# Altium schematic sheet Motor Interface - Connectors.SchDoc: Motor Interface - Connectors
size B; Organization: Midnight Sun Solar Rayce Car Team; Address1: University of Waterloo; Address2: 200 University Ave W; Address3: Waterloo, ON, Canada; Address4: N2L 3E9; DocumentNumber: 2; SheetNumber: 2; SheetTotal: 6; Website: www.uwmidsun.com
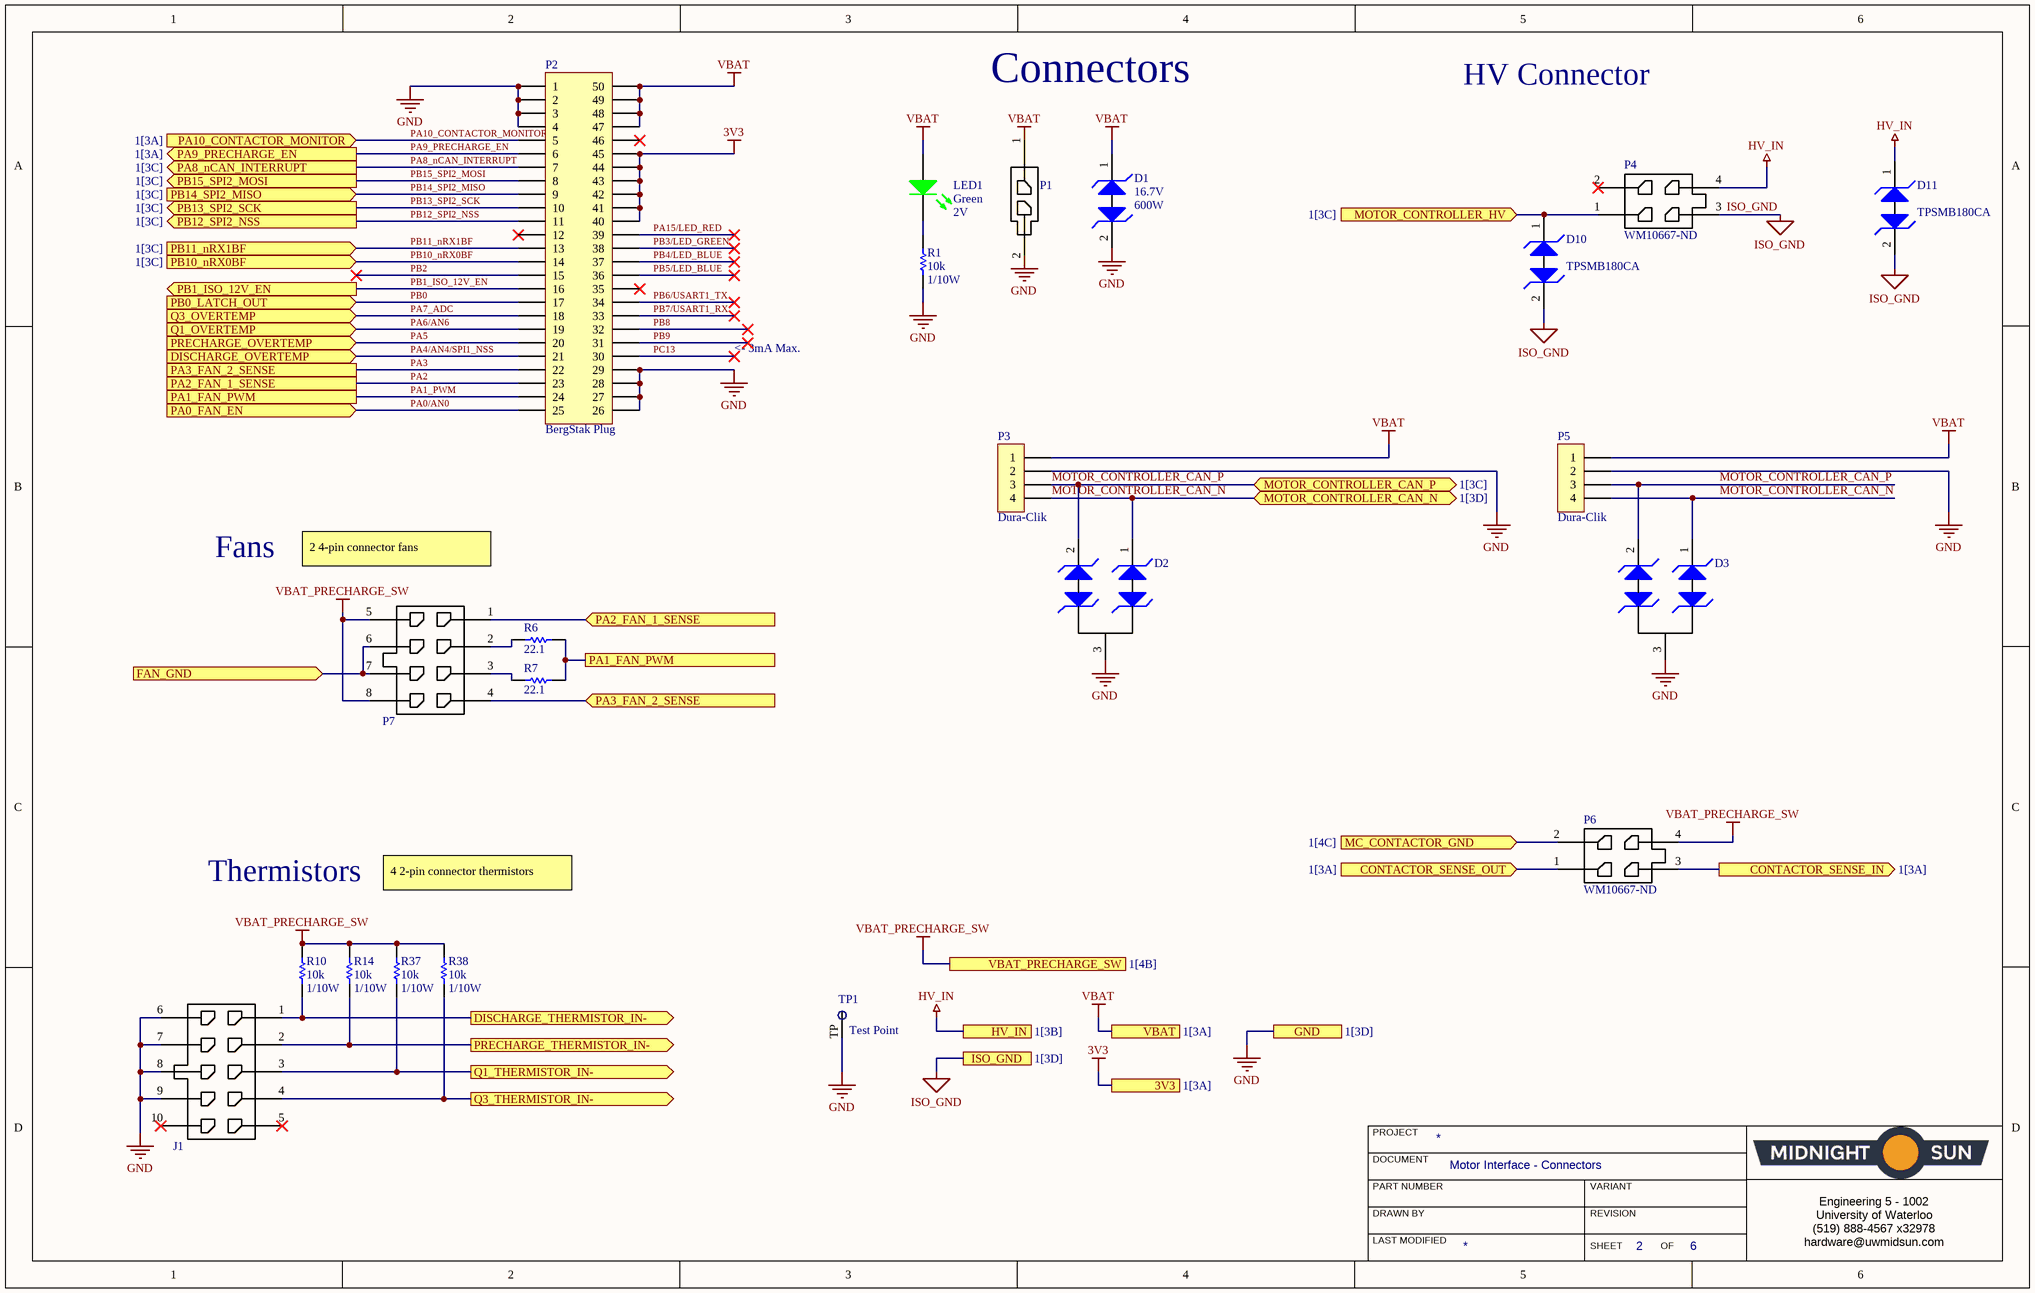
[diagram p0: Motor Interface - Connectors.SchDoc]

## Parts
D1  Voltage - Breakdown (Min): 16.7V  Power - Peak Pulse: 600W  [DO-214AA Diode]  (hidden comment: DIODE TVS 15VWM 24.4VC DO-214AA (SMB))
D2  DIODE TVS 24VWM 70VC SOT23  [MOSFET P-CH 30V 3.8A SOT-23]  (value not drawn)
D3  DIODE TVS 24VWM 70VC SOT23  [MOSFET P-CH 30V 3.8A SOT-23]  (value not drawn)
D10  Manufacturer Part Number: TPSMB180CA  [DIODE TVS TPSMB 600W DO-214AA SMB]  (hidden comment: TVS DIODE 154V 246V DO214AA)
D11  Manufacturer Part Number: TPSMB180CA  [DIODE TVS TPSMB 600W DO-214AA SMB]  (hidden comment: TVS DIODE 154V 246V DO214AA)
J1  CONN 10POS MICRO-FIT 3mm  [CONN, 10POS MICRO-FIT 3mm]  (value not drawn)
LED1  Color: Green  Voltage - Forward (Vf) (Typ): 2V  [LED_0603]  (hidden comment: LED GREEN CLEAR 2V 0603)
P1  CONN 2POS MICRO-FIT 3mm  [CONN, 2POS MICRO-FIT]  (value not drawn)
P2  Series: BergStak Plug  [CONN, Bergstak 50 Pos Plug]  (hidden comment: CONN 50POS Bergstak Plug 0.02")
P3  Dura-Clik  [CONN, 4POS DURA-CLIK VERT]
P4  Supplier Part Number 1: WM10667-ND  [CONN 4POS MICROFIT (2x2)]  (hidden comment: CONN 4POS MICRO-FIT 3mm)
P5  Dura-Clik  [CONN, 4POS DURA-CLIK VERT]
P6  Supplier Part Number 1: WM10667-ND  [CONN 4POS MICROFIT (2x2)]  (hidden comment: CONN 4POS MICRO-FIT 3mm)
P7  CONN 8POS MICRO-FIT 3mm  [CONN, 8POS MICRO-FIT]  (value not drawn)
R1  Resistance: 10k  Power: 1/10W  [RES, 0603]  (hidden comment: RES 10K OHM 1% 1/10W 0603)
R6  Resistance: 22.1  [RES, 0603]  (hidden comment: RES 22.1 OHM 1% 1/10W 0603)
R7  Resistance: 22.1  [RES, 0603]  (hidden comment: RES 22.1 OHM 1% 1/10W 0603)
R10  Resistance: 10k  Power: 1/10W  [RES, 0603]  (hidden comment: RES 10K OHM 1% 1/10W 0603)
R14  Resistance: 10k  Power: 1/10W  [RES, 0603]  (hidden comment: RES 10K OHM 1% 1/10W 0603)
R37  Resistance: 10k  Power: 1/10W  [RES, 0603]  (hidden comment: RES 10K OHM 1% 1/10W 0603)
R38  Resistance: 10k  Power: 1/10W  [RES, 0603]  (hidden comment: RES 10K OHM 1% 1/10W 0603)
TP1  Test Point  [Test Point]

## Ports
3V3 (see 1[3A]), CONTACTOR_SENSE_IN (out, see 1[3A]), CONTACTOR_SENSE_OUT (in, see 1[3A]), DISCHARGE_OVERTEMP (in), DISCHARGE_THERMISTOR_IN- (out), FAN_GND (in), GND (see 1[3D]), HV_IN (see 1[3B]), ISO_GND (see 1[3D]), MC_CONTACTOR_GND (in, see 1[4C]), MOTOR_CONTROLLER_CAN_N (bidir, see 1[3D]), MOTOR_CONTROLLER_CAN_P (bidir, see 1[3C]), MOTOR_CONTROLLER_HV (in, see 1[3C]), PA0_FAN_EN (in), PA1_FAN_PWM, PA2_FAN_1_SENSE, PA2_FAN_1_SENSE (in), PA3_FAN_2_SENSE, PA3_FAN_2_SENSE (in), PA8_nCAN_INTERRUPT (out, see 1[3C]), PA9_PRECHARGE_EN (out, see 1[3A]), PA10_CONTACTOR_MONITOR (in, see 1[3A]), PB0_LATCH_OUT (in), PB1_ISO_12V_EN (out), PB10_nRX0BF (in, see 1[3C]), PB11_nRX1BF (in, see 1[3C]), PB12_SPI2_NSS (out, see 1[3C]), PB13_SPI2_SCK (out, see 1[3C]), PB14_SPI2_MISO (in, see 1[3C]), PB15_SPI2_MOSI (out, see 1[3C]), PRECHARGE_OVERTEMP (in), PRECHARGE_THERMISTOR_IN- (out), Q1_OVERTEMP (in), Q1_THERMISTOR_IN- (out), Q3_OVERTEMP (in), Q3_THERMISTOR_IN- (out), VBAT (see 1[3A]), VBAT_PRECHARGE_SW (see 1[4B])

## Nets
3V3: P2.40 P2.41 P2.42 P2.43 P2.44 P2.45 ; port 3V3
GND: D1.2(Cathode2) D2.3(Common_Cathode) D3.3(Common_Cathode) J1.6 J1.7 J1.8 J1.9 P1.2 P2.1 P2.2 P2.3 P2.4 P2.26 P2.27 P2.28 P2.29 P3.2 P5.2 R1.2 TP1.TP ; port GND
HV_IN: D11.1(Cathode1) P4.4 ; port HV_IN
ISO_GND: D10.2(Cathode2) D11.2(Cathode2) P4.3 ; port ISO_GND
VBAT: D1.1(Cathode1) LED1.1(A) P1.1 P2.47 P2.48 P2.49 P2.50 P3.1 P5.1 ; port VBAT
VBAT_PRECHARGE_SW: P6.4 P7.5 P7.8 R10.1 R14.1 R37.1 R38.1 ; port VBAT_PRECHARGE_SW
CONTACTOR_SENSE_IN: P6.3 ; port CONTACTOR_SENSE_IN
CONTACTOR_SENSE_OUT: P6.1 ; port CONTACTOR_SENSE_OUT
DISCHARGE_THERMISTOR_IN-: J1.1 R10.2 ; port DISCHARGE_THERMISTOR_IN-
FAN_GND: P7.6 P7.7 ; port FAN_GND
MC_CONTACTOR_GND: P6.2 ; port MC_CONTACTOR_GND
MOTOR_CONTROLLER_CAN_N: D2.1(Cathode1) D3.1(Cathode1) P3.4 P5.4 ; port MOTOR_CONTROLLER_CAN_N
MOTOR_CONTROLLER_CAN_P: D2.2(Cathode2) D3.2(Cathode2) P3.3 P5.3 ; port MOTOR_CONTROLLER_CAN_P
MOTOR_CONTROLLER_HV: D10.1(Cathode1) P4.1 ; port MOTOR_CONTROLLER_HV
PA0/AN0: P2.25 ; port PA0_FAN_EN
PA1_PWM: P2.24 R6.2 R7.2 ; port PA1_FAN_PWM
PA2: P2.23 P7.1 ; port PA2_FAN_1_SENSE
PA3: P2.22 P7.4 ; port PA3_FAN_2_SENSE
PA4/AN4/SPI1_NSS: P2.21 ; port DISCHARGE_OVERTEMP
PA5: P2.20 ; port PRECHARGE_OVERTEMP
PA6/AN6: P2.19 ; port Q1_OVERTEMP
PA7_ADC: P2.18 ; port Q3_OVERTEMP
PA8_nCAN_INTERRUPT: P2.7 ; port PA8_nCAN_INTERRUPT
PA9_PRECHARGE_EN: P2.6 ; port PA9_PRECHARGE_EN
PA10_CONTACTOR_MONITOR: P2.5 ; port PA10_CONTACTOR_MONITOR
PA15/LED_RED: P2.39
PB0: P2.17 ; port PB0_LATCH_OUT
PB1_ISO_12V_EN: P2.16 ; port PB1_ISO_12V_EN
PB2: P2.15
PB3/LED_GREEN: P2.38
PB4/LED_BLUE: P2.37
PB5/LED_BLUE: P2.36
PB6/USART1_TX: P2.34
PB7/USART1_RX: P2.33
PB8: P2.32
PB9: P2.31
PB10_nRX0BF: P2.14 ; port PB10_nRX0BF
PB11_nRX1BF: P2.13 ; port PB11_nRX1BF
PB12_SPI2_NSS: P2.11 ; port PB12_SPI2_NSS
PB13_SPI2_SCK: P2.10 ; port PB13_SPI2_SCK
PB14_SPI2_MISO: P2.9 ; port PB14_SPI2_MISO
PB15_SPI2_MOSI: P2.8 ; port PB15_SPI2_MOSI
PC13: P2.30
PRECHARGE_THERMISTOR_IN-: J1.2 R14.2 ; port PRECHARGE_THERMISTOR_IN-
Q1_THERMISTOR_IN-: J1.3 R37.2 ; port Q1_THERMISTOR_IN-
Q3_THERMISTOR_IN-: J1.4 R38.2 ; port Q3_THERMISTOR_IN-
NetLED1_2: LED1.2(K) R1.1
NetP7_2: P7.2 R6.1
NetP7_3: P7.3 R7.1

Not connected (* = marked no-connect by the designer): J1 5* 10*; P2 12* 35* 46*; P4 2*

## Notes on the sheet
- Connectors
- HV Connector
- <- 3mA Max.
- Fans
- 2 4-pin connector fans
- Thermistors
- 4 2-pin connector thermistors
- PROJECT
- DOCUMENT
- DRAWN BY
- LAST MODIFIED
- PART NUMBER
- REVISION
- SHEET
- VARIANT
- OF
- Engineering 5 - 1002
  University of Waterloo
  (519) 888-4567 x32978
  hardware@uwmidsun.com

## Library data of the parts
D1 = DIODE TVS 15VWM 24.4VC DO-214AA (SMB): TVS DIODE 15VWM 24.4VC SMB; Manufacturer 1: Fairchild/ON Semiconductor; Manufacturer Part Number 1: SMBJ15CA; Type: Zener; Voltage - Reverse Standoff (Typ): 15V; Voltage - Clamping (Max) @ Ipp: 24.4V; Current - Peak Pulse (10/1000µs): 24.6A; Power Line Protection: No; Supplier 1: Digi-Key; Supplier Part Number 1: SMBJ15CAFSCT-ND; RoHS: RoHS Compliant; Description 1: TVS DIODE 15VWM 24.4VC SMB; Category: Circuit Protection; Stock 1: 24965; Pricing 1: 1=0.54, 10=0.444, 100=0.3027, 500=0.22704, 1000=0.17028 (CAD); Packaging: Cut Tape (CT); Part Status: Active; Applications: General Purpose; Capacitance @ Frequency: -; Operating Temperature: -55°C ~ 150°C (TJ); Mounting Type: Surface Mount; Package / Case: DO-214AA, SMB; Supplier Device Package: DO-214AA (SMB); ComponentLink1URL: https://www.fairchildsemi.com/datasheets/SM/SMBJ10CA.pdf; ComponentLink1Description: https://www.fairchildsemi.com/datasheets/SM/SMBJ10CA.pdf
D2 D3 = DIODE TVS 24VWM 70VC SOT23: TVS DIODE 24VWM 70VC SOT23; Manufacturer 1: Nexperia USA Inc.; Manufacturer Part Number 1: PESD1CAN,215; Type: Zener; Voltage - Breakdown (Min): 25.4V; Voltage - Clamping (Max) @ Ipp: 70V; Current - Peak Pulse (10/1000µs): 3A (8/20µs); Power - Peak Pulse: 200W; Power Line Protection: No; Capacitance @ Frequency: 11pF @ 1MHz; Supplier 1: Digi-Key; Supplier Part Number 1: 1727-3817-1-ND; Packaging: Cut Tape (CT); Part Status: Active; Operating Temperature: -65°C ~ 150°C (TA); Mounting Type: Surface Mount; Package / Case: TO-236-3, SC-59, SOT-23-3; Supplier Device Package: SOT-23 (TO-236AB); ComponentLink1URL: http://assets.nexperia.com/documents/data-sheet/PESD1CAN.pdf; ComponentLink1Description: http://assets.nexperia.com/documents/data-sheet/PESD1CAN.pdf
D10 D11 = DIODE TVS 154V 246V DO-2144A (SMB): Manufacturer: Littelfuse; Supplier 1: Digi-Key; Stock 1: 2900; Pricing 1: 1=0.84, 10=0.734, 25=0.6504, 100=0.5664, 250=0.493, 500=0.41958, 1000=0.33566 (USD); Supplier Part Number 1: F10356CT-ND
J1 = CONN 10POS MICRO-FIT 3mm: Connector Header Through Hole 10 position 0.118" (3.00mm); Manufacturer: Molex, LLC; Manufacturer Part Number: 0430451027; Number of Positions: 10; Number of Positions Loaded: All; Style: Board to Cable/Wire; Shrouding: Shrouded - 4 Wall; Contact Length - Post: 0.125" (3.18mm); Material Flammability Rating: UL94 V-0; Supplier 1: Digi-Key; RoHS: RoHS Compliant; Category: Connectors, Interconnects; Stock 1: 8114; Pricing 1: 1=3.15, 10=2.864, 100=2.455, 500=2.0458, 1224=1.75355, 6120=1.55481 (CAD); Packaging: Tray; Part Status: Active; Connector Type: Header; Contact Type: Male Pin; Pitch - Mating: 0.118" (3.00mm); Number of Rows: 2; Row Spacing - Mating: 0.118" (3.00mm); Mounting Type: Through Hole; Termination: Solder; Fastening Type: Locking Ramp; Contact Length - Mating: -; Overall Contact Length: -; Insulation Height: 0.390" (9.91mm); Contact Shape: Square; Contact Finish - Mating: Tin; Contact Finish Thickness - Mating: 60.0µin (1.52µm); Contact Finish - Post: Tin; Contact Material: Brass; Insulation Material: Liquid Crystal Polymer (LCP), Glass Filled; Features: Board Guide; Operating Temperature: -; Ingress Protection: -; Insulation Color: Black; Current Rating: -; Voltage Rating: -; Mated Stacking Heights: -; Contact Finish Thickness - Post: -; Applications: General Purpose, Medical, Military, Telecommunications; ComponentLink1URL: https://www.molex.com/pdm_docs/sd/430451027_sd.pdf; ComponentLink1Description: https://www.molex.com/pdm_docs/sd/430451027_sd.pdf; Supplier Part Number 1: WM7488-ND
LED1 = LED GREEN CLEAR 2V 0603: Green 572nm LED Indication - Discrete 2V 0603 (1608 Metric); Manufacturer: Wurth Electronics Inc.; Manufacturer Part Number: 150060VS75000; Lens Color: Colorless; Millicandela Rating: 40mcd; Lens Style/Size: Rectangle with Flat Top, 1.10mm x 0.70mm; Current - Test: 20mA; Viewing Angle: 140°; Wavelength - Dominant: 570nm; Supplier 1: Digi-Key; RoHS: RoHS Compliant; Category: Optoelectronics; Stock 1: 9408; Pricing 1: 1=0.21, 100=0.1617, 500=0.13964 (CAD); Packaging: Cut Tape (CT); Part Status: Active; Lens Transparency: Clear; Mounting Type: Surface Mount; Wavelength - Peak: 572nm; Features: -; Package / Case: 0603 (1608 Metric); Supplier Device Package: 0603; Size / Dimension: 1.60mm L x 0.80mm W; Height (Max): 0.80mm; ComponentLink1URL: http://katalog.we-online.de/led/datasheet/150060VS75000.pdf; ComponentLink1Description: http://katalog.we-online.de/led/datasheet/150060VS75000.pdf; Supplier Part Number 1: 732-4980-1-ND
P1 = CONN 2POS MICRO-FIT 3mm: Connector Header Through Hole 2 position; Manufacturer: Molex; Manufacturer Part Number: 43045-0227; Number of Positions: 2; Gender: Male; Contact Resistance: 10mR; Number of Ports: 1; Max Voltage Rating (DC): 250.25kV; Current Rating: 5A; Voltage Rating: 600V; Glow Wire Compliant: Compliant; Supplier 1: Digi-Key; Stock 1: 3657; Pricing 1: 1=0.84, 10=0.74, 25=0.6968, 50=0.6676, 100=0.6387, 250=0.5806, 500=0.52254, 1000=0.46448, 2500=0.42094 (USD); Mount: Through Hole; Contact Plating: Tin; Contact Material: Brass; Housing Colour: Black; Housing Material: Thermoplastic; Number of Terminals: 2; Min Operating Temperature: -40°C; Max Operating Temperature: 105°C; Number of Rows: 2; Packaging: Tray; Termination: Solder; Number of Contacts: 2; Orientation: Vertical; Package Quantity: 3168; Number of Circuits: 2; Length: 7.15mm; Pitch: 3mm; Depth: 8.77mm; Row Spacing: 3mm; Radiation Hardening: No; Halogen Free: Low Halogen; ComponentLink1URL: http://www.onlinecomponents.com/productFiles/mf-MOL/307170430450227_pcb_headers.pdf; ComponentLink1Description: http://www.onlinecomponents.com/productFiles/mf-MOL/307170430450227_pcb_headers.pdf; ComponentLink2URL: http://www.mouser.com/ds/2/276/0430450227_PCB_HEADERS-142611.pdf; ComponentLink2Description: http://www.mouser.com/ds/2/276/0430450227_PCB_HEADERS-142611.pdf; ComponentLink3URL: http://uk.rs-online.com/webdocs/13c3/0900766b813c3a46.pdf; ComponentLink3Description: http://uk.rs-online.com/webdocs/13c3/0900766b813c3a46.pdf; ComponentLink4URL: http://www.molex.com/webdocs/datasheets/pdf/en-us/0430450227_PCB_HEADERS.pdf; ComponentLink4Description: http://www.molex.com/webdocs/datasheets/pdf/en-us/0430450227_PCB_HEADERS.pdf; Supplier Part Number 1: WM10657-ND
P2 = CONN 50POS Bergstak Plug 0.02": 50 Position Connector Plug, Outer Shroud Contacts Surface Mount Gold; Manufacturer 1: Amphenol FCI; Manufacturer Part Number 1: 10132797-055100LF; Number of Positions: 50; Mated Stacking Heights: 5mm; Pitch: 0.020" (0.50mm); Supplier 1: Digi-Key; Supplier Part Number 1: 609-5226-1-ND; Packaging: Cut Tape (CT); Part Status: Active; Connector Type: Plug, Outer Shroud Contacts; Number of Rows: 2; Mounting Type: Surface Mount; Contact Finish: Gold; Contact Finish Thickness: 1µin (0.025µm); Height Above Board: 0.169" (4.30mm); ComponentLink1URL: http://portal.fciconnect.com/Comergent//fci/drawing/10132797.pdf; ComponentLink1Description: http://portal.fciconnect.com/Comergent//fci/drawing/10132797.pdf
P3 P5 = CONN 4POS DURA-CLIK 0.079": 4 Positions Header Connector 0.079" (2.00mm) Surface Mount Tin; Manufacturer: Molex, LLC; Manufacturer Part Number: 5600200420; Style: Board to Cable/Wire; Shrouding: Shrouded - 4 Wall; Number of Positions: 4; Number of Positions Loaded: All; Mated Stacking Heights: 9.3mm; Supplier 1: Digi-Key; RoHS: RoHS Compliant; Category: Connectors, Interconnects; Stock 1: 9367; Pricing 1: 1=2.23, 10=2.022, 25=1.898, 50=1.8156, 100=1.733 (CAD); Packaging: Cut Tape (CT); Part Status: Active; Connector Type: Header; Contact Type: Male Pin; Pitch - Mating: 0.079" (2.00mm); Number of Rows: 1; Row Spacing - Mating: -; Mounting Type: Surface Mount; Termination: Solder; Fastening Type: Latch Lock; Contact Length - Mating: -; Contact Length - Post: -; Overall Contact Length: -; Insulation Height: 0.315" (8.00mm); Contact Shape: Square; Contact Finish - Mating: Tin; Contact Finish Thickness - Mating: -; Contact Finish - Post: Tin; Contact Material: Copper Alloy; Insulation Material: Polyamide (PA), Nylon; Features: Solder Retention; Operating Temperature: -; Ingress Protection: -; Material Flammability Rating: -; Insulation Color: Natural; Current Rating: -; Voltage Rating: -; Contact Finish Thickness - Post: -; Applications: Automotive, Industrial; ComponentLink1URL: http://www.molex.com/pdm_docs/sd/5600200420_sd.pdf; ComponentLink1Description: http://www.molex.com/pdm_docs/sd/5600200420_sd.pdf; Supplier Part Number 1: WM10864CT-ND
P4 P6 = CONN 4POS MICRO-FIT 3mm: Micro-Fit 3.0 Vertical Header, 3.00mm Pitch, Dual Row, 4 Circuits, with PCB Polarizing Peg, Tin, Glow-Wire Capable, Black; Manufacturer: Molex, LLC; Manufacturer Part Number: 0430450827; Pitch - Mating: 0.118" (3.00mm); Number of Positions: 6; Number of Positions Loaded: All; Style: Board to Cable/Wire; Shrouding: Shrouded - 4 Wall; Contact Length - Post: 0.125" (3.18mm); Material Flammability Rating: UL94 V-0; Contact Resistance: 10mR; Number of Contacts: 4; Number of Ports: 1; Row Spacing: 0.118inch; RoHS: RoHS Compliant; Category: Connectors, Interconnects; Packaging: Tray; Part Status: Active; Connector Type: Header; Contact Type: Male Pin; Number of Rows: 2; Row Spacing - Mating: 0.118" (3.00mm); Mounting Type: Through Hole; Termination: Solder; Fastening Type: Locking Ramp; Contact Length - Mating: -; Overall Contact Length: -; Insulation Height: 0.390" (9.91mm); Contact Shape: Square; Contact Finish - Mating: Tin; Contact Finish Thickness - Mating: 60.0µin (1.52µm); Contact Finish - Post: Tin; Contact Material: Brass; Insulation Material: Liquid Crystal Polymer (LCP), Glass Filled; Features: Board Guide; Operating Temperature: -; Ingress Protection: -; Insulation Color: Black; Current Rating: -; Voltage Rating: -; Mated Stacking Heights: -; Contact Finish Thickness - Post: -; Applications: General Purpose, Medical, Military, Telecommunications; ComponentLink1URL: https://www.molex.com/pdm_docs/sd/430450627_sd.pdf; ComponentLink1Description: https://www.molex.com/pdm_docs/sd/430450627_sd.pdf; ComponentLink2URL: https://www.molex.com/pdm_docs/sd/430450827_sd.pdf; ComponentLink2Description: https://www.molex.com/pdm_docs/sd/430450827_sd.pdf; Mount: Through Hole; Contact Plating: Tin; Housing Material: Polymer; Color: Black; Number of Terminals: 4; Housing Color: Black; Min Operating Temperature: -40°C; Max Operating Temperature: 105°C; Package Quantity: 2232; Orientation: Straight; Length: 10.15mm; Pitch: 3mm; Depth: 8.77mm; ComponentLink3URL: http://www.molex.com/pdm_docs/sd/430450427_sd.pdf; ComponentLink3Description: http://www.molex.com/pdm_docs/sd/430450427_sd.pdf; ComponentLink4URL: http://www.molex.com/webdocs/datasheets/pdf/en-us/0430450427_PCB_HEADERS.pdf; ComponentLink4Description: http://www.molex.com/webdocs/datasheets/pdf/en-us/0430450427_PCB_HEADERS.pdf; Supplier 1: Digi-Key
P7 = CONN 8POS MICRO-FIT 3mm: Connector Header Through Hole 6 position 0.118" (3.00mm); Manufacturer: Molex, LLC; Manufacturer Part Number: 0430450827; Number of Positions: 6; Number of Positions Loaded: All; Style: Board to Cable/Wire; Shrouding: Shrouded - 4 Wall; Contact Length - Post: 0.125" (3.18mm); Material Flammability Rating: UL94 V-0; RoHS: RoHS Compliant; Category: Connectors, Interconnects; Packaging: Tray; Part Status: Active; Connector Type: Header; Contact Type: Male Pin; Pitch - Mating: 0.118" (3.00mm); Number of Rows: 2; Row Spacing - Mating: 0.118" (3.00mm); Mounting Type: Through Hole; Termination: Solder; Fastening Type: Locking Ramp; Contact Length - Mating: -; Overall Contact Length: -; Insulation Height: 0.390" (9.91mm); Contact Shape: Square; Contact Finish - Mating: Tin; Contact Finish Thickness - Mating: 60.0µin (1.52µm); Contact Finish - Post: Tin; Contact Material: Brass; Insulation Material: Liquid Crystal Polymer (LCP), Glass Filled; Features: Board Guide; Operating Temperature: -; Ingress Protection: -; Insulation Color: Black; Current Rating: -; Voltage Rating: -; Mated Stacking Heights: -; Contact Finish Thickness - Post: -; Applications: General Purpose, Medical, Military, Telecommunications; ComponentLink1URL: https://www.molex.com/pdm_docs/sd/430450627_sd.pdf; ComponentLink1Description: https://www.molex.com/pdm_docs/sd/430450627_sd.pdf; Supplier 1: Digi-Key; Stock 1: 5553; Pricing 1: 1=2.69, 10=2.445, 25=2.2964, 50=2.1964, 100=2.0965, 250=1.8968, 500=1.74704, 1440=1.49746, 2880=1.39763 (CAD); ComponentLink2URL: https://www.molex.com/pdm_docs/sd/430450827_sd.pdf; ComponentLink2Description: https://www.molex.com/pdm_docs/sd/430450827_sd.pdf; Supplier Part Number 1: WM10684-ND
R1 R10 R14 R37 R38 = RES 10K OHM 1% 1/10W 0603: RES SMD 10K OHM 1% 1/10W 0603; Manufacturer 1: Yageo; Manufacturer Part Number 1: RC0603FR-0710KL; Temperature Coefficient: ±100ppm/°C; Supplier 1: Digi-Key; Supplier Part Number 1: 311-10.0KHRCT-ND; Packaging: Cut Tape (CT); Part Status: Active; Composition: Thick Film; Operating Temperature: -55°C ~ 155°C; Package / Case: 0603 (1608 Metric); Supplier Device Package: 0603; Size / Dimension: 0.063" L x 0.031" W (1.60mm x 0.80mm); Height - Seated (Max): 0.022" (0.55mm); Failure Rate: -; ComponentLink1URL: http://www.yageo.com/documents/recent/PYu-RC_Group_51_RoHS_L_7.pdf; ComponentLink1Description: http://www.yageo.com/documents/recent/PYu-RC_Group_51_RoHS_L_7.pdf; Tolerance: ±1%
R6 R7 = RES 22.1 OHM 1% 1/10W 0603: 22.1 Ohm ±1% 0.1W, 1/10W Chip Resistor 0603 (1608 Metric) Moisture Resistant Thick Film; Manufacturer 1: Yageo; Manufacturer Part Number 1: RC0603FR-0722R1L; Temperature Coefficient: ±100ppm/°C; Supplier 1: Digi-Key; Supplier Part Number 1: 311-22.1HRCT-ND; Packaging: Cut Tape (CT); Part Status: Active; Composition: Thick Film; Operating Temperature: -55°C ~ 155°C; Package / Case: 0603 (1608 Metric); Supplier Device Package: 0603; Size / Dimension: 0.063" L x 0.031" W (1.60mm x 0.80mm); Height - Seated (Max): 0.022" (0.55mm); Failure Rate: -; ComponentLink1URL: http://www.yageo.com/documents/recent/PYu-RC_Group_51_RoHS_L_7.pdf; ComponentLink1Description: http://www.yageo.com/documents/recent/PYu-RC_Group_51_RoHS_L_7.pdf; Tolerance: ±1%